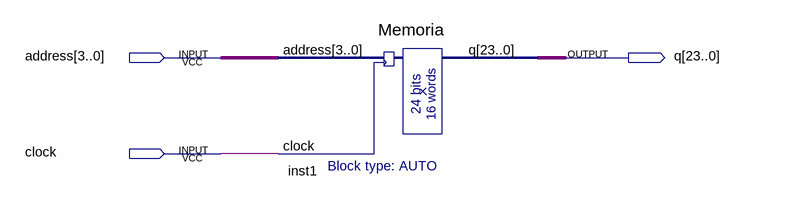
[diagram p0: schematic sheet]
// Quartus schematic TestMemoria.bdf as structural Verilog: 1 symbols, 3 pins
module TestMemoria (
  input  [3:0] address,
  input  clock,
  output [23:0] q
);

  Memoria inst1 (.address(address), .clock(clock), .q(q));
endmodule
